# Altium schematic sheet usb_uart.SchDoc: USB - serial converters
size 297 x 209 mm; DrawnBy: TW; Engineer: TW
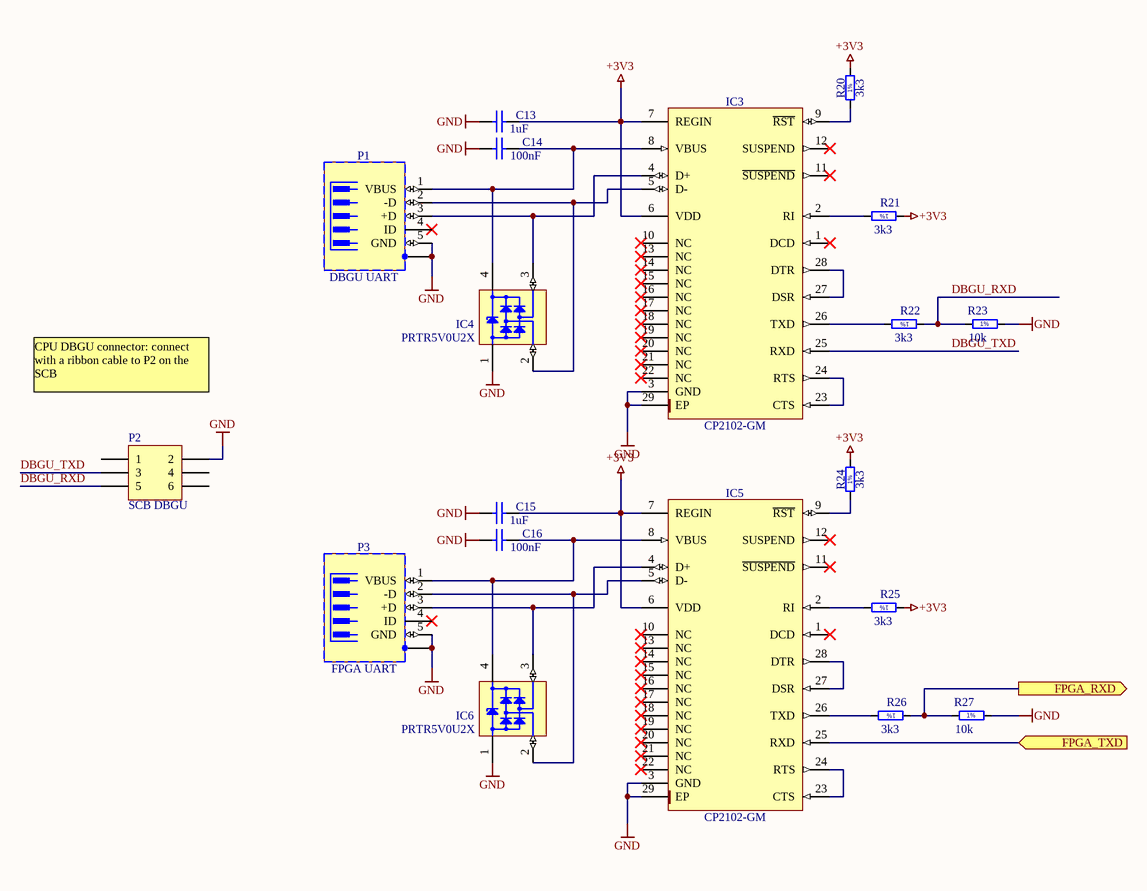
[diagram p0: usb_uart.SchDoc]

## Parts
C13  1uF  [CAPC1608X87N]
C14  100nF  [CAPC1608X87N]
C15  1uF  [CAPC1608X87N]
C16  100nF  [CAPC1608X87N]
IC3  CP2102-GM  [QFN50P500X500X100-29N-S335]
IC4  PRTR5V0U2X  [SOT190P230X110-4N]
IC5  CP2102-GM  [QFN50P500X500X100-29N-S335]
IC6  PRTR5V0U2X  [SOT190P230X110-4N]
P1  DBGU UART  [TYCO_1734035-1]
P2  SCB DBGU  [HDR2X3]
P3  FPGA UART  [TYCO_1734035-1]
R20  3k3  [RESC1608X55N]
R21  3k3  [RESC1608X55N]
R22  3k3  [RESC1608X55N]
R23  10k  [RESC1608X55N]
R24  3k3  [RESC1608X55N]
R25  3k3  [RESC1608X55N]
R26  3k3  [RESC1608X55N]
R27  10k  [RESC1608X55N]

## Ports
FPGA_RXD (out), FPGA_TXD (in)

## Nets
+3V3: C13.1 C15.1 IC3.6(VDD) IC3.7(REGIN) IC5.6(VDD) IC5.7(REGIN) R20.2 R21.1 R24.2 R25.1
GND: C13.2 C14.2 C15.2 C16.2 IC3.3(GND) IC3.29(EP) IC4.1(GND) IC5.3(GND) IC5.29(EP) IC6.1(GND) P1.5(GND) P1.6(SH) P2.2 P3.5(GND) P3.6(SH) R23.2 R27.2
DBGU_RXD: P2.5 R22.1 R23.1
DBGU_TXD: IC3.25(RXD) P2.3
FPGA_RXD: R26.1 R27.1 ; port FPGA_RXD
FPGA_TXD: IC5.25(RXD) ; port FPGA_TXD
NetC14_1: C14.1 IC3.8(VBUS) IC4.4(VCC) P1.1(VBUS)
NetC16_1: C16.1 IC5.8(VBUS) IC6.4(VCC) P3.1(VBUS)
NetIC3_2: IC3.2(RI) R21.2
NetIC3_4: IC3.4(D+) IC4.3(I/O2) P1.3(+D)
NetIC3_5: IC3.5(D-) IC4.2(I/O1) P1.2(-D)
NetIC3_9: IC3.9(~{RST}) R20.1
NetIC3_23: IC3.23(CTS) IC3.24(RTS)
NetIC3_26: IC3.26(TXD) R22.2
NetIC3_27: IC3.27(DSR) IC3.28(DTR)
NetIC5_2: IC5.2(RI) R25.2
NetIC5_4: IC5.4(D+) IC6.3(I/O2) P3.3(+D)
NetIC5_5: IC5.5(D-) IC6.2(I/O1) P3.2(-D)
NetIC5_9: IC5.9(~{RST}) R24.1
NetIC5_23: IC5.23(CTS) IC5.24(RTS)
NetIC5_26: IC5.26(TXD) R26.2
NetIC5_27: IC5.27(DSR) IC5.28(DTR)

Not connected (* = marked no-connect by the designer): IC3 1(DCD)* 10(NC)* 11(~{SUSPEND})* 12(SUSPEND)* 13(NC)* 14(NC)* 15(NC)* 16(NC)* 17(NC)* 18(NC)* 19(NC)* 20(NC)* 21(NC)* 22(NC)*; IC5 1(DCD)* 10(NC)* 11(~{SUSPEND})* 12(SUSPEND)* 13(NC)* 14(NC)* 15(NC)* 16(NC)* 17(NC)* 18(NC)* 19(NC)* 20(NC)* 21(NC)* 22(NC)*; P1 4(ID)*; P2 1 4 6; P3 4(ID)*

## Notes on the sheet
- CPU DBGU connector: connect with a ribbon cable to P2 on the SCB
- Project/Equipment
- Document
- Designer
- Drawn by
- Check.by
- File
- Last Mod.
- Print Date
- Sheet
- Size
- A4
- of
- Rev
- (in symbol R0603_3K3_1%_0.1W_100PPM) 1%
- (in symbol R0603_10K_1%_0.1W_100PPM) 1%

## Library data of the parts
C13 C15 = CC0603_1UF_16V_10%_X7R: Non-polarised capacitor; Part Description: SMD Multilayer Chip Ceramic Capacitor; Manufacturer: GENERIC; Manufacturer1 Part Number: 223824613663; Voltage: 16V; TC: X7R; Tolerance: ±10%; Table: Capacitors SMD; Part Number: CC0603_1UF_16V_10%_X7R; Component Kind: Standard; Component Type: Standard; Pin Count: 2; Value: 1uF; Status: Preferred; Manufacturer Part Number: CC0603_1uF_16V_10%_X7R; Case: 0603; Mounted: Yes; Socket: No; SMD: Yes; Manufacturer1 Example: PHYCOMP; Manufacturer1 ComponentHeight: 0.87mm; HelpURL: \\cern.ch\dfs\Applications\Altium\Datasheets\CC0805_X5R_PHYCOMP_HC.pdf; Author: CERN DEM JLC; CreateDate: 12/3/2007; LatestRevisionDate: 12/3/2007
C14 C16 = CC0603_100NF_50V_10%_X7R: Non-polarised capacitor; Part Description: SMD Multilayer Chip Ceramic Capacitor; Manufacturer: GENERIC; Manufacturer1 Part Number: 223858615649; Voltage: 50V; TC: X7R; Tolerance: ±10%; Table: Capacitors SMD; Part Number: CC0603_100NF_50V_10%_X7R; Component Kind: Standard; Component Type: Standard; Pin Count: 2; Value: 100nF; Status: Preferred; Manufacturer Part Number: CC0603_100NF_50V_10%_X7R; Case: 0603; Mounted: Yes; Socket: No; SMD: Yes; Manufacturer1 Example: PHYCOMP; Manufacturer1 ComponentHeight: 0.87mm; HelpURL: \\cern.ch\dfs\Applications\Altium\Datasheets\CC0603_X7R_PHYCOMP.pdf; Author: CERN DEM JLC; CreateDate: 03/12/2007; LatestRevisionDate: 03/12/2007
IC3 IC5 = CP2102-GM: Single-Chip USB to UART Bridge; Manufacturer: SILICON LABS; Table: Analog & Interface; Part Number: CP2102-GM; Component Kind: Standard; Component Type: Standard; Device: CP2102-GM; PackageDescription: QFN, 0.50mm Pitch, Square; 28 pin, 5.00mm L X 5.00mm W X 1.00mm H body (w/thermal tab 3.35 X 3.35mm),  IPC Medium Density; Part Description: Single-Chip USB to UART Bridge; Manufacturer Part Number: CP2102-GM; Pin Count: 29; Case: QFN28; Mounted: Yes; Socket: No; SMD: Yes; ComponentHeight: 1.0mm; Author: CERN DEM JLC; HelpURL: \\cern.ch\dfs\Applications\Altium\Datasheets\CP2102-GM.pdf; CreateDate: 3/3/2011; LatestRevisionDate: 3/3/2011
IC4 IC6 = PRTR5V0U2X: Ultra Low Capacitance Double Rail-to-Rail ESD Protection Diode; Part Description: Ultra Low Capacitance (1pF) Double Rail-to-Rail ESD Protection Diode (8kV); Manufacturer: PHILIPS NXP; Voltage: 5.5V; Table: Diodes; Part Number: PRTR5V0U2X; Component Kind: Standard; Component Type: Standard; Device: PRTR5V0U2X; PackageDescription: SOT143B, SOT, 1.90mm Pitch; 4 Pin, 1.30mm W X 2.90mm L X 1.10mm H body, IPC Medium Density; Manufacturer Part Number: PRTR5V0U2X; Pin Count: 4; Case: SOT143B; Mounted: Yes; Socket: No; SMD: Yes; ComponentHeight: 1.1mm; HelpURL: \\cern.ch\dfs\Applications\Altium\Datasheets\PRTR5V0U2X.pdf; Author: CERN DEM JLC; CreateDate: 3/22/2011; LatestRevisionDate: 3/22/2011
P1 P3 = TYCO_1734035-1: 5 Pin + 1 Shield USB Receptacle; Part Description: 5 Position, Right Angle, SMD Mini USB Type B Receptacle; Manufacturer: TYCO ELECTRONICS; Table: TYCO; Part Number: TYCO_1734035-1; Component Kind: Standard; Component Type: Standard; Pin Count: 6; Family: USB; Mounted: Yes; Socket: No; SMD: Yes; Status: None; Manufacturer Part Number: 1734035-1; ComponentHeight: 3.95mm; HelpURL: \\cern.ch\dfs\Applications\Altium\Datasheets\TYCO_1734035-1.pdf; Author: CERN DEM JLC; CreateDate: 02/05/2011; LatestRevisionDate: 02/05/2011
P2 = MHDR2X3: Header, 3-Pin, Dual row, 2.54mm pitch; Manufacturer1: FCI; Value: 75869-131LF; LatestRevisionDate: 17-Jul-2002; LatestRevisionNote: Re-released for DXP Platform.; Publisher: Altium Limited; Distributor1: Digikey; Distributor1 PN: 609-2845-ND
R20-R22 R24-R26 = R0603_3K3_1%_0.1W_100PPM: Resistor - 1%; Part Description: General Purpose Thick Film Chip Resistor; Manufacturer: GENERIC; Manufacturer1 Part Number: NRC06F3301TRF; Power: 0.1W; TC: ±100ppm/°C; Table: Resistors SMD; Part Number: R0603_3K3_1%_0.1W_100PPM; Component Kind: Standard; Component Type: Standard; Pin Count: 2; Value: 3k3; Status: Preferred; Tolerance: ±1%; Manufacturer Part Number: R0603_3K3_1%_0.1W_100PPM; Case: 0603; Mounted: Yes; Socket: No; SMD: Yes; Manufacturer1 Example: NIC COMPONENT; Manufacturer1 ComponentHeight: 0.55mm; HelpURL: \\cern.ch\dfs\Applications\Altium\Datasheets\R0603_NIC_NRC.pdf; Author: CERN DEM JLC; CreateDate: 12/3/2007; LatestRevisionDate: 3/13/2008
R23 R27 = R0603_10K_1%_0.1W_100PPM: Resistor - 1%; Part Description: General Purpose Thick Film Chip Resistor; Manufacturer: GENERIC; Manufacturer1 Part Number: NRC06F1002TRF; Power: 0.1W; TC: ±100ppm/°C; Table: Resistors SMD; Part Number: R0603_10K_1%_0.1W_100PPM; Component Kind: Standard; Component Type: Standard; Pin Count: 2; Value: 10k; Status: Preferred; Tolerance: ±1%; Manufacturer Part Number: R0603_10K_1%_0.1W_100PPM; Case: 0603; Mounted: Yes; Socket: No; SMD: Yes; Manufacturer1 Example: NIC COMPONENT; Manufacturer1 ComponentHeight: 0.55mm; HelpURL: \\cern.ch\dfs\Applications\Altium\Datasheets\R0603_NIC_NRC.pdf; Author: CERN DEM JLC; CreateDate: 12/3/2007; LatestRevisionDate: 3/13/2008